# Altium schematic sheet eVPS_Sensor.SchDoc: eVPS_Sensor
size A4; DrawnBy: Ivica Matovic; Revision: v1.1; SheetNumber: 3; SheetTotal: 3
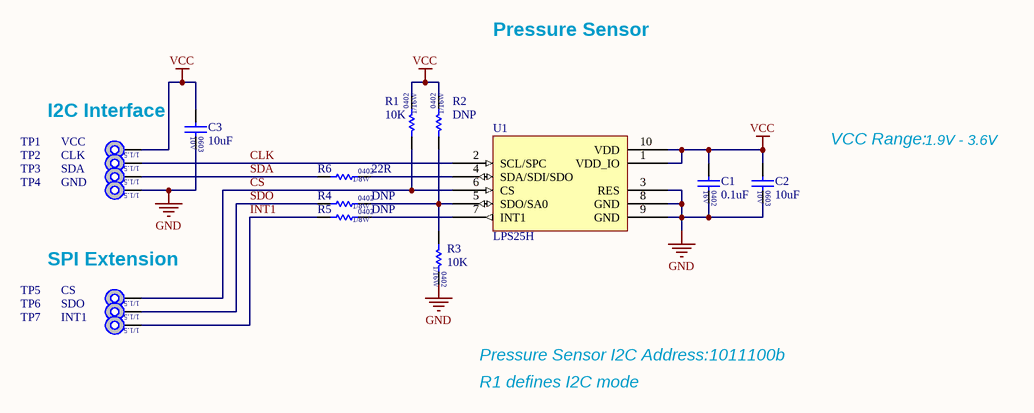
[diagram p0: eVPS_Sensor.SchDoc]

## Parts
C1  0.1uF  [CAPC1005X60N]
C2  10uF  [CAPC1608X95B]
C3  10uF  [CAPC1608X95B]
R1  10K  [RESC1005X40AN]
R2  DNP  [RESC1005X40AN]
R3  10K  [RESC1005X40AN]
R4  DNP  [RESC1005X40AN]
R5  DNP  [RESC1005X40AN]
R6  22R  [RESC1005X40AN]
TP1  VCC  [TEST_POINT_TH_1.5MM]  (no BOM)
TP2  CLK  [TEST_POINT_TH_1.5MM]  (no BOM)
TP3  SDA  [TEST_POINT_TH_1.5MM]  (no BOM)
TP4  GND  [TEST_POINT_TH_1.5MM]  (no BOM)
TP5  CS  [TEST_POINT_TH_1.5MM]  (no BOM)
TP6  SDO  [TEST_POINT_TH_1.5MM]  (no BOM)
TP7  INT1  [TEST_POINT_TH_1.5MM]  (no BOM)
U1  LPS25H  [STM_HCLGA10L]

## Nets
GND: C1.2 C2.2 C3.2 R3.2 TP4.1 U1.3(RES) U1.8(GND) U1.9(GND)
VCC: C1.1 C2.1 C3.1 R1.2 R2.2 TP1.1 U1.1(VDD_IO) U1.10(VDD)
~{CS}: R1.1 TP5.1 U1.6(CS)
CLK: TP2.1 U1.2(SCL/SPC)
INT1: R5.2 TP7.1
SDA: R6.2 TP3.1
SDO: R4.2 TP6.1
NetR2_1: R2.1 R3.1 R4.1 U1.5(SDO/SA0)
NetR5_1: R5.1 U1.7(INT1)
NetR6_1: R6.1 U1.4(SDA/SDI/SDO)

## Notes on the sheet
- Pressure Sensor
- I2C Interface
- VCC Range:
- 1.9V - 3.6V
- SPI Extension
- Pressure Sensor I2C Address:
- 1011100b
- R1 defines I2C mode
- Title:
- Bitgear
- Size:
- Date:
- Drawn By:
- A
- Doc. No:
- Time:
- Checked By:
- Sheet
- Rev:
- of
- Stevana Markovica 8
- 11080 Belgrade
- Serbia
- www.bitgear.rs
- Approved By:
- File:
- (in symbol Cap-1005 (0402) CER 0.1UF 16V X7R 10%) 16V
- (in symbol Cap-1608 (0603) CER 10uF 10V X5R 20%) 10V
- (in symbol Res-1005 (0402) 10 KOhm 1/16 1%) 0402; 1/16W
- (in symbol Res-1005 (0402) 22 Ohm 1/8W 1%) 0402; 1/8W
- (in symbol TP TH 1X1.5mm) 1/1.5

## Library data of the parts
C1 = Cap-1005 (0402) CER 0.1UF 16V X7R 10%: CAP CER 0.1UF 0402 (1005) 16V X7R 10%; Manufacturer: Murata Electronics North America; D P/N: 490-3261-1-ND; D Price: 0.1; M P/N: GRM155R71C104KA88D; S MOQ: 10000; S P/N: 490-3261-2-ND; S Price: 0.00462; Distributor: Digikey; Mounting: SMD; Supplier: Digi Key; Package: 0402; Value: 0.1uF
C2 C3 = Cap-1608 (0603) CER 10uF 10V X5R 20%: Capacitor Ceramic 10uF 1608 (0603) 10V X5R 20%; Manufacturer: Taiyo Yuden; D P/N: 587-3412-1-ND; D Price: 0.4; M P/N: LMK107BBJ106MAHT; S MOQ: 4000; S P/N: 587-3412-2-ND; S Price: 0.08296; Distributor: Digikey; Mounting: SM; Supplier: Digi Key; Package: 0603; Value: 10uF
R1 R3 = Res-1005 (0402) 10 KOhm 1/16 1%: RES 10 KOhm 1/16W 1% 0402 SMD; Manufacturer: Yageo; D P/N: 311-10.0KLRCT-ND; D Price: 0.10; M P/N: RC0402FR-0710KL; S P/N: 311-10.0KLRTR-ND; S MOQ: 10000; S Price: 0.00152; Distributor: Digikey; Mounting: SM; Supplier: Digi Key; Value: 10K
R2 = Res-1005 (0402) 10 KOhm 1/16 1%: RES 10 KOhm 1/16W 1% 0402 SMD; Manufacturer: Yageo; D P/N: 311-10.0KLRCT-ND; D Price: 0.10; M P/N: RC0402FR-0710KL; S P/N: 311-10.0KLRTR-ND; S MOQ: 10000; S Price: 0.00152; Value: 10K; Distributor: Digikey; Mounting: SM; Supplier: Digi Key
R4 R5 = Res-1005 (0402) 22 Ohm 1/8W 1%: Manufacturer: Vishay Dale; D P/N: 541-22.0YCT-ND; D Price: 0.020; M P/N: CRCW040222R0FKEDHP; S MOQ: 10000; S P/N: 541-22.0YTR-ND; S Price: 0.02376; Value: 22R; Distributor: Digikey; Mounting: SM; Supplier: Digi Key
R6 = Res-1005 (0402) 22 Ohm 1/8W 1%: Manufacturer: Vishay Dale; D P/N: 541-22.0YCT-ND; D Price: 0.020; M P/N: CRCW040222R0FKEDHP; S MOQ: 10000; S P/N: 541-22.0YTR-ND; S Price: 0.02376; Distributor: Digikey; Mounting: SM; Supplier: Digi Key; Value: 22R
TP1-TP7 = TP TH 1X1.5mm: Test point Through Hole; D P/N: TESTP; D Price: 0; M P/N: TESTP; Mounting: SM
U1 = LPS25H: MEMS Pressure Sensor; Manufacturer: ST Microelectronics; M P/N: LPS25HTR; D P/N: 497-14380-1-ND; D Price: 4.14; S MOQ: 1000; S Price: 2.07; Mounting: SMD; Distributor: Digikey; Supplier: Digi Key; S P/N: 497-14380-1-ND; Value: Pressure